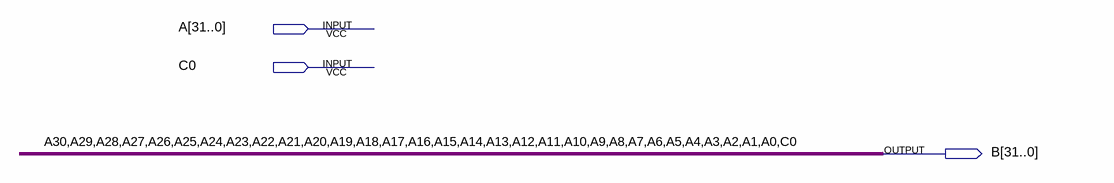
[diagram p0: schematic sheet]
// Quartus schematic SL_32BIT.bdf as structural Verilog: 0 symbols, 3 pins
module SL_32BIT (
  input  [31:0] A,
  input  C0,
  output [31:0] B
);


  assign B = {A[30:0], C0};
endmodule
